# EAGLE board VCAMatrixBottom (EAGLE 8.0.2), part 1 of 2
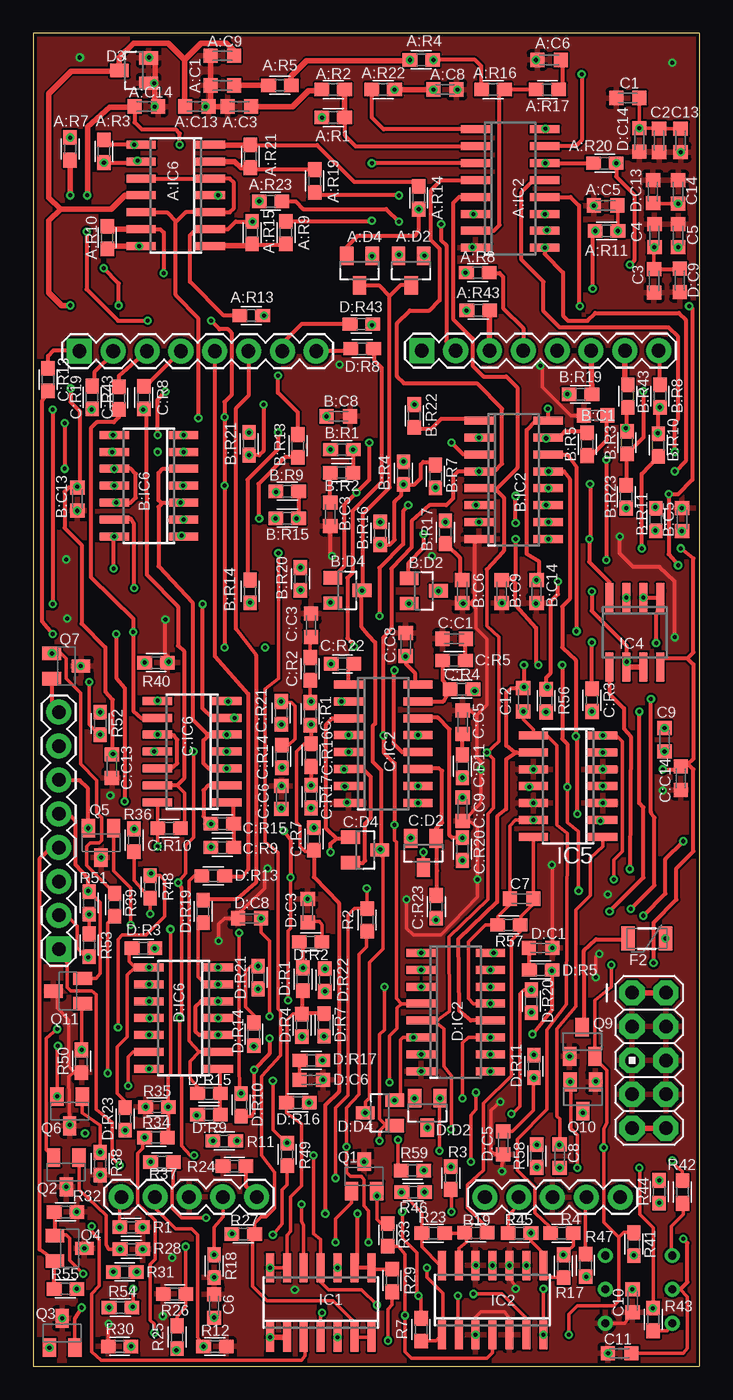
[diagram p2: board, top side]
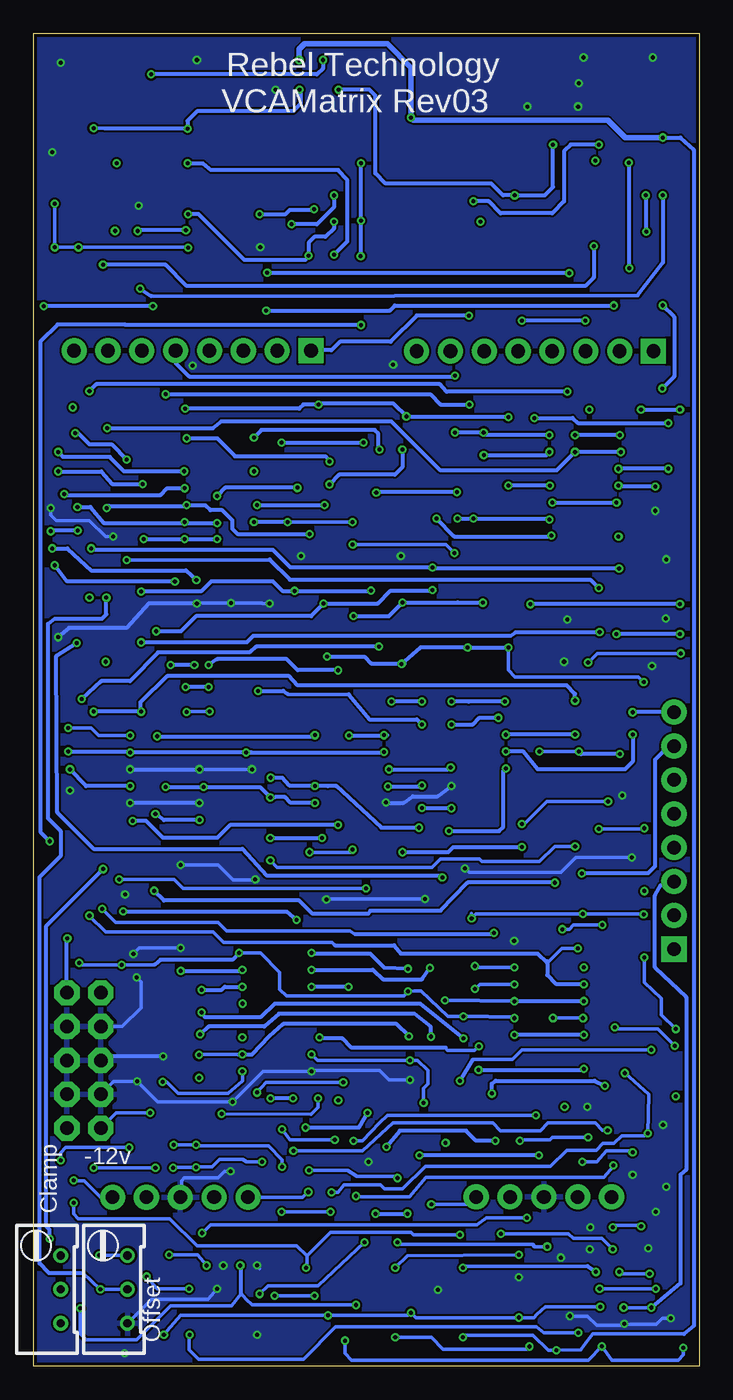
[diagram p3: board, bottom side, seen from below]

Size 50 x 100 mm. Coordinates in mm from the lower left corner, seen from the top.
Outline: 50,100 0,100 0,0 50,0 50,100
Copper layers (1*16): Top 0.035mm / dielectric 1.5mm / Bottom 0.035mm
Design rules "SeeedStudio_2layer_DRU_no_angle_20140221": minimum track width 6mil, minimum drill 12mil, track to track 6mil, track to pad 6mil, pad to pad 6mil, via to via 6mil, smd to smd 0mil, copper to edge 10mil, drill to drill 10mil, minimum pad ring 10mil, minimum via ring 6mil, stop-mask expansion 2mil, vias tented up to drill 100mil, thermal gap 10mil

## Footprints (pad centres in the part's own frame; a part is rotated, then mirrored left to right if it is on the bottom)
C0603K = smd 1.05 x 1.08: 1 -0.875,0; 2 0.875,0
SOT23 = smd 1 x 1.4: 1 -0.95,-1.1; 2 0.95,-1.1; 3 0,1.1
SOIC16N = smd 0.6 x 2.2: 1 -4.445,-2.6; 2 -3.175,-2.6; 3 -1.905,-2.6; 4 -0.635,-2.6; 5 0.635,-2.6; 6 1.905,-2.6; 7 3.175,-2.6; 8 4.445,-2.6; 9 4.445,2.6; 10 3.175,2.6; 11 1.905,2.6; 12 0.635,2.6; 13 -0.635,2.6; 14 -1.905,2.6; 15 -3.175,2.6; 16 -4.445,2.6
SO14 = smd 0.6 x 2.2: 1 -3.81,-2.6; 2 -2.54,-2.6; 3 -1.27,-2.6; 4 0,-2.6; 5 1.27,-2.6; 6 2.54,-2.6; 7 3.81,-2.6; 8 3.81,2.6; 9 2.54,2.6; 10 1.27,2.6; 11 0,2.6; 12 -1.27,2.6; 13 -2.54,2.6; 14 -3.81,2.6
0603 = smd 1.1 x 1: 1 -0.85,0; 2 0.85,0
RTRIM64W = drill 0.61: 1 1.27,-2.54; 2 1.27,0; 3 1.27,2.54
PTC-1206 = smd 1 x 1.8: 1 -1.4,0; 2 1.4,0
SO08 = smd 0.6 x 2.2: 1 -1.905,-2.6; 2 -0.635,-2.6; 3 0.635,-2.6; 4 1.905,-2.6; 5 1.905,2.6; 6 0.635,2.6; 7 -0.635,2.6; 8 -1.905,2.6
1X05 = drill 1.016 pad 1.88: 1 0,0; 2 2.54,0; 3 5.08,0; 4 7.62,0; 5 10.16,0
1X08 = drill 1.016 pad 1.88 square: 1 0,0 | drill 1.016 pad 1.88: 2 2.54,0; 3 5.08,0; 4 7.62,0; 5 10.16,0; 6 12.7,0; 7 15.24,0; 8 17.78,0
AVR_ICSP = drill 1.016 pad 1.88 octagon: 1 -1.27,5.08; 2 1.27,5.08; 3 -1.27,2.54; 4 1.27,2.54; 5 -1.27,0; 6 1.27,0; 7 -1.27,-2.54; 8 1.27,-2.54; 9 -1.27,-5.08; 10 1.27,-5.08
SOT23-BEC = smd 1 x 1.4: B -0.95,-1.1; C 0,1.1; E 0.95,-1.1

## Placement (x,y rotation side)
A:C1  560p  [C0603K]  14.19,96.1 180 top
A:C3  560p  [C0603K]  15.46,94.51 180 top
A:C5  560p  [C0603K]  42.96,87.08 180 top
A:C6  560p  [C0603K]  38.7,98 180 top
A:C8  100n  [C0603K]  30.89,95.78 0 top
A:C9  100n  [C0603K]  14.19,98.32 0 top
A:C13  100n  [C0603K]  12.29,94.51 0 top
A:C14  100n  [C0603K]  8.48,94.51 0 top
A:D2  BAT54A  [SOT23]  28.35,82.19 180 top
A:D4  BAT54A  [SOT23]  24.48,82.19 180 top
A:IC2  SSM2164S  [SOIC16N]  35.78,88.35 270 top
A:IC6  QUAD_OPAMPD  [SO14]  10.7,87.84 90 top
A:R1  30k  [0603]  22.51,93.68 0 top
A:R2  500  [0603]  22.51,95.78 0 top
A:R3  68k  [0603]  5.3,91.14 270 top
A:R4  30k  [0603]  29.11,98 180 top
A:R5  500  [0603]  18.51,96.1 0 top
A:R7  30k  [0603]  2.76,91.33 270 top
A:R8  100k  [0603]  33.35,82.04 0 top
A:R9  560  [0603]  18.95,85.05 90 top
A:R10  68k  [0603]  5.56,84.67 90 top
A:R11  500  [0603]  43.02,85.18 180 top
A:R13  100k  [0603]  16.36,78.82 0 top
A:R14  560  [0603]  28.92,87.65 270 top
A:R15  68k  [0603]  16.41,85.05 90 top
A:R16  30k  [0603]  34.51,95.78 0 top
A:R17  500  [0603]  38.58,95.78 180 top
A:R19  100k  [0603]  21.11,88.92 270 top
A:R20  560  [0603]  42.89,90.26 180 top
A:R21  68k  [0603]  16.29,90.76 270 top
A:R22  5k6  [0603]  26.26,95.78 0 top
A:R23  560  [0603]  17.81,87.4 180 top
A:R43  100k  [0603]  33.39,79.22 0 top
B:C1  560p  [C0603K]  42.21,71.33 180 top
B:C3  560p  [C0603K]  22.28,63.92 270 top
B:C5  560p  [C0603K]  48.68,63.52 90 top
B:C6  560p  [C0603K]  32.2,58.12 270 top
B:C8  100n  [C0603K]  22.88,71.26 0 top
B:C9  100n  [C0603K]  35.16,58.12 90 top
B:C13  100n  [C0603K]  3.31,65.05 270 top
B:C14  100n  [C0603K]  37.76,58.12 270 top
B:D2  BAT54A  [SOT23]  29.31,58.17 270 top
B:D4  BAT54A  [SOT23]  23.57,58.2 270 top
B:IC2  SSM2164S  [SOIC16N]  36.05,66.5 270 top
B:IC6  QUAD_OPAMPD  [SO14]  8.68,66.06 90 top
B:R1  30k  [0603]  23.16,68.76 0 top
B:R2  500  [0603]  23.14,67.04 0 top
B:R3  68k  [0603]  44.56,69.29 90 top
B:R4  30k  [0603]  27.78,67.01 90 top
B:R5  500  [0603]  41.57,69.17 90 top
B:R7  30k  [0603]  30.18,66.75 270 top
B:R8  100k  [0603]  47.03,72.79 90 top
B:R9  560  [0603]  19.06,65.65 180 top
B:R10  68k  [0603]  46.9,69.1 90 top
B:R11  500  [0603]  46.71,63.52 90 top
B:R13  100k  [0603]  19.85,69.04 90 top
B:R14  560  [0603]  16.26,58.13 270 top
B:R15  68k  [0603]  19.06,63.62 180 top
B:R16  30k  [0603]  26.03,62.5 90 top
B:R17  500  [0603]  30.93,62.56 90 top
B:R19  100k  [0603]  41.06,72.91 0 top
B:R20  560  [0603]  20.04,59.07 270 top
B:R21  68k  [0603]  16.2,69.21 270 top
B:R22  5k6  [0603]  28.6,71.29 90 top
B:R23  560  [0603]  44.49,65.23 90 top
B:R43  100k  [0603]  44.62,72.79 90 top
C1  100n  [C0603K]  44.62,95.14 180 top
C2  100n  [C0603K]  46.97,91.96 270 top
C3  100n  [C0603K]  46.59,81.42 270 top
C4  100n  [C0603K]  46.61,84.82 90 top
C5  100n  [C0603K]  48.39,84.82 90 top
C6  100n  [C0603K]  13.57,4.52 90 top
C7  100p  [C0603K]  36.64,35.07 180 top
C8  100p  [C0603K]  39.5,15.77 270 top
C9  100p  [C0603K]  47.38,47.01 270 top
C10  4u7  [C0603K]  44.96,4.91 270 top
C11  4u7  [C0603K]  44.01,0.97 180 top
C12  100p  [C0603K]  36.77,49.99 90 top
C13  100n  [C0603K]  48.58,91.97 270 top
C14  100n  [C0603K]  48.39,88.09 90 top
C:C1  560p  [C0603K]  31.59,54.58 180 top
C:C3  560p  [C0603K]  20.85,55.58 90 top
C:C5  560p  [C0603K]  32.22,48.32 90 top
C:C6  560p  [C0603K]  18.62,42.66 90 top
C:C8  100n  [C0603K]  27.94,54.14 90 top
C:C9  100n  [C0603K]  32.21,41.79 90 top
C:C13  100n  [C0603K]  5.91,45.01 270 top
C:C14  100n  [C0603K]  48.59,44.12 270 top
C:D2  BAT54A  [SOT23]  29.28,38.5 180 top
C:D4  BAT54A  [SOT23]  24.91,38.73 270 top
C:IC2  SSM2164S  [SOIC16N]  26.27,46.71 270 top
C:IC6  QUAD_OPAMPD  [SO14]  11.92,46.11 90 top
C:R1  30k  [0603]  20.78,48.95 90 top
C:R2  500  [0603]  20.78,52.31 270 top
C:R3  68k  [0603]  41.93,49.97 90 top
C:R4  30k  [0603]  32.15,50.79 180 top
C:R5  500  [0603]  31.58,52.95 180 top
C:R7  30k  [0603]  21.05,39.55 90 top
C:R8  100k  [0603]  8.3,72.67 90 top
C:R9  560  [0603]  14.18,38.92 180 top
C:R10  68k  [0603]  10.2,40.35 0 top
C:R11  500  [0603]  32.21,45.01 270 top
C:R13  100k  [0603]  1.11,74.02 90 top
C:R14  560  [0603]  18.64,45.75 270 top
C:R15  68k  [0603]  14.18,40.69 180 top
C:R16  30k  [0603]  20.85,45.84 270 top
C:R17  500  [0603]  20.85,42.73 90 top
C:R19  100k  [0603]  4.41,72.68 90 top
C:R20  560  [0603]  32.21,38.79 90 top
C:R21  68k  [0603]  18.61,49.01 270 top
C:R22  5k6  [0603]  23.2,52.7 180 top
C:R23  560  [0603]  30.24,34.47 270 top
C:R43  100k  [0603]  6.43,72.63 90 top
CLAMP  [RTRIM64W]  49.22,5.76 0 bottom
D3  BAT54A  [SOT23]  7.56,97.21 90 top
D:C1  560p  [C0603K]  38.08,31.38 0 top
D:C3  560p  [C0603K]  20.6,34.17 90 top
D:C5  560p  [C0603K]  35.26,16.75 270 top
D:C6  560p  [C0603K]  20.87,21.48 0 top
D:C8  100n  [C0603K]  16.23,33.6 180 top
D:C9  100n  [C0603K]  48.52,81.46 90 top
D:C13  100n  [C0603K]  46.5,88.12 90 top
D:C14  100n  [C0603K]  45.48,92 270 top
D:D2  BAT54A  [SOT23]  29.57,19 180 top
D:D4  BAT54A  [SOT23]  26.01,19 90 top
D:IC2  SSM2164S  [SOIC16N]  31.71,26.57 270 top
D:IC6  QUAD_OPAMPD  [SO14]  11.28,26.11 90 top
D:R1  30k  [0603]  20.23,29.04 90 top
D:R2  500  [0603]  20.81,31.83 180 top
D:R3  68k  [0603]  8.27,31.35 0 top
D:R4  30k  [0603]  20.16,25.57 270 top
D:R5  500  [0603]  38.08,29.73 0 top
D:R7  30k  [0603]  21.82,25.61 270 top
D:R8  100k  [0603]  24.68,76.34 180 top
D:R9  560  [0603]  13.19,18.88 180 top
D:R10  68k  [0603]  15.59,19.6 90 top
D:R11  500  [0603]  37.57,22.49 90 top
D:R13  100k  [0603]  13.5,36.78 0 top
D:R14  560  [0603]  16.55,24.91 270 top
D:R15  68k  [0603]  13.19,20.46 180 top
D:R16  30k  [0603]  19.85,19.76 0 top
D:R17  500  [0603]  20.87,22.94 0 top
D:R19  100k  [0603]  12.74,34.12 90 top
D:R20  560  [0603]  37.38,27.38 90 top
D:R21  68k  [0603]  16.87,29.16 270 top
D:R22  5k6  [0603]  21.89,28.97 270 top
D:R23  560  [0603]  6.9,18.56 90 top
D:R43  100k  [0603]  24.62,78.18 180 top
F2  PTCSMD  [PTC-1206]  46.04,32.09 180 top
IC1  QUAD_OPAMPD  [SO14]  21.57,4.78 0 top
IC2  QUAD_OPAMPD  [SO14]  34.47,4.95 0 top
IC4  TL072D  [SO08]  45.15,55.05 180 top
IC5  QUAD_OPAMPD  [SO14]  40.14,43.52 90 top
J3  [1X05]  16.76,12.7 180 top
J4  [1X05]  33.89,12.68 0 top
JP1  [1X08]  29.16,76.19 0 top
JP3  [1X08]  3.45,76.16 0 top
JP5  [1X08]  1.91,31.29 90 top
JP8  M05X2PTH  [AVR_ICSP]  46.21,22.94 0 top
OFFSET  [RTRIM64W]  44.21,5.76 0 bottom
Q1  BC856ALT1SMD  [SOT23-BEC]  24.83,14.24 0 top
Q2  BC856ALT1SMD  [SOT23-BEC]  2.48,14.56 180 top
Q3  BC856ALT1SMD  [SOT23-BEC]  2.16,2.49 0 top
Q4  BC856ALT1SMD  [SOT23-BEC]  2.74,8.84 270 top
Q5  BC856ALT1SMD  [SOT23-BEC]  5.08,39.26 180 top
Q6  BC856ALT1SMD  [SOT23-BEC]  2.74,19.13 180 top
Q7  BC856ALT1SMD  [SOT23-BEC]  2.48,52.53 270 top
Q9  BSS84  [SOT23]  41.2,24.34 0 top
Q10  BSS123  [SOT23]  41.24,20.23 180 top
Q11  BC856ALT1SMD  [SOT23-BEC]  2.61,28.15 90 top
R1  100k  [0603]  7.34,10.43 180 top
R2  100k  [0603]  25.06,33.48 270 top
R3  100k  [0603]  31.34,14.12 270 top
R4  100k  [0603]  39.67,9.99 0 top
R7  100k  [0603]  29.1,2.75 270 top
R11  100k  [0603]  14.33,16.91 180 top
R12  100k  [0603]  13.63,1.48 180 top
R17  100k  [0603]  39.79,7.51 270 top
R18  100k  [0603]  13.57,7.51 90 top
R19  100k  [0603]  33.21,10.01 180 top
R23  100k  [0603]  30.01,9.99 180 top
R24  100k  [0603]  15.09,15 0 top
R25  100k  [0603]  10.8,2.18 90 top
R26  22k  [0603]  10.61,5.42 0 top
R27  100k  [0603]  15.75,9.92 180 top
R28  22k  [0603]  7.37,8.78 180 top
R29  100k  [0603]  26.93,6.43 270 top
R30  22k  [0603]  6.48,1.48 0 top
R31  100k  [0603]  6.86,7.07 180 top
R32  22k  [0603]  2.42,11.57 180 top
R33  4k7  [0603]  26.61,9.86 270 top
R34  100k  [0603]  9.21,17.16 0 top
R35  22k  [0603]  9.28,19.45 0 top
R36  4k7  [0603]  7.56,39.45 270 top
R37  100k  [0603]  9.66,15.32 180 top
R38  22k  [0603]  5.02,15.19 90 top
R39  100k  [0603]  6.1,34.62 90 top
R40  22k  [0603]  9.21,52.79 180 top
R41  10k  [0603]  45.06,9.16 90 top
R42  10k  [0603]  48.72,13.07 90 top
R43  10k  [0603]  46.52,3.51 270 top
R44  1k  [0603]  46.97,13.1 270 top
R45  1k  [0603]  36.49,9.99 0 top
R46  1k  [0603]  28.51,13.06 180 top
R47  1k  [0603]  41.44,7.57 270 top
R48  4k7  [0603]  8.77,35.96 270 top
R49  100k  [0603]  19.05,15.89 90 top
R50  22k  [0603]  3.62,22.88 90 top
R51  4k7  [0603]  4.2,34.75 270 top
R52  4k7  [0603]  5.02,48.21 270 top
R53  4k7  [0603]  4.2,31.58 90 top
R54  4k7  [0603]  6.55,4.4 0 top
R55  4k7  [0603]  2.42,5.8 0 top
R56  30k  [0603]  38.49,49.93 270 top
R57  30k  [0603]  35.69,33.1 0 top
R58  30k  [0603]  37.79,15.77 90 top
R59  30k  [0603]  28.45,14.69 0 top

## Tracks (layer width: path | path; a pad name or v marks a point on that pad's centre or on a via)
+12V  (via drill 0.3)
  Top 0.254: R53.2 R51.2 | 21.66,1.67 21.69,1.45 IC1.4 21.57,3.99 v21.66,4.02 | v4.2,51.33 4.2,48.13 R52.2 | v17.72,26.24 17.72,31.89 17.09,32.53 17.09,33.58 D:C8.1 | v27.88,3.8 27.91,4.1 | R33.2 27.4,9.01 27.88,8.4 v27.88,3.8 | v43.38,30.12 43.38,28.46 42.15,27.43 Q9.2 42.17,22.97 42.61,22.62 43.06,22.18 43.06,18.24 42.8,17.8 v42.8,16.4 42.8,10.81 43.95,9.67 | C13.1 C2.1 46.93,92.87 D:C14.1 45.48,95.13 C1.1 | IC2.4 34.47,1.01 34.04,0.59 28.39,0.59 27.88,1.1 v27.88,3.8 | v7.5,5.8 7.5,4.44 v7.46,4.46 | v40.2,2.37 40.2,3.89 40.83,4.53 43.57,4.53 43.95,4.91 43.95,9.67 | 44.91,9.86 R41.2 45.02,10.05 44.33,10.05 43.95,9.67 | v47.95,15.45 47.95,15.26 48.71,14.62 48.71,13.93 R42.2 | R36.2 7.56,36.44 R48.2 v8.77,33.93
  Top 0.305: v13.34,78.44 13.97,77.81 14.61,77.81 14.88,77.54 14.88,72.87 14.36,72.34 v14.36,71.2 v14.36,66.06 v14.36,53.93 | 11.34,66.06 11.41,65.99 11.31,65.99 v11.24,66.06 | Q9.2 42.04,23.2 | 34.34,2.29 IC2.4 | v4.01,85.11 4.01,80.79 6.35,78.44 v8.58,78.44 | B:IC2.16 38.8,70.95 38.87,71.01 | v10.99,91.65 10.99,92.47 10.67,92.79 8.13,92.79 7.6,93.32 A:C14.1 | B:IC2.16 38.65,70.98 38.68,71.01 | v38.61,71.84 38.61,70.98 B:IC2.16 | A:IC2.16 38.38,92.81 v38.42,92.85 | B:IC2.16 37.72,70.95 37.02,70.25 37.02,60.94 37.98,60.36 37.98,59.22 B:C14.1 | 47.06,52.34 47.06,53.15 | 47.06,53.15 IC4.8 | 27.93,52.8 v27.94,53.23 27.94,52.72 28.64,52.02 28.64,51.38 C:IC2.16 28.7,51.24 | 47.06,53.15 49.14,53.15 | 49.14,53.15 49.53,53.55 49.53,60.6 v48.58,61.36 | R52.2 v5.02,47.39 | D:C8.1 17.09,33.61 | v47.25,44.79 48.32,44.79 C:C14.1 49.11,45.2 | 49.14,53.15 49.14,53.06 49.53,52.66 49.53,45.56 49.11,45.2 | 42.1,23.26 Q9.2 | 42.2,23.17 Q9.2 | 42.46,23.74 Q9.2 | R51.2 4.3,33.88 | 49.11,45.2 49.53,44.78 49.53,38.62 48.26,37.36 48.26,35.01 46.55,33.29 v46.55,30.24
  Top 0.406: v13.87,87.84 A:IC6.4 | A:C8.1 30,95.78 30.07,95.86 A:C8.1 | 14.57,46.15 C:IC6.4 | 28.53,51.24 C:IC2.16 28.69,51.22 | 11.34,66.06 B:IC6.4 | 47.11,53.1 IC4.8 | 7.52,94.43 A:C14.1 7.53,94.44 5.72,94.44 4.07,92.98 4.07,88 v4.03,87.84 | D:IC2.16 v34.54,31.01 v34.55,31 | A:R22.2 A:C8.1 | 7.5,4.44 7.71,4.44 R54.2 | C:C8.1 v27.94,53.23
  Bottom 0.254: D:C8.1 17.1,33.98 | v17.72,26.24 18.86,26.24 20.9,28.15 21.4,28.15 D:R22.2 22.18,27.77 30.99,27.77 31.5,28.27 31.5,29.54 32.96,31 v34.55,31 | 17.03,33.67 D:C8.1 | v14.36,53.93 14.36,52.21 13.85,51.71 4.58,51.71 v4.2,51.33 | 40.9,30.12 v43.38,30.12 46.42,30.12 v46.55,30.24 | R55.2 v7.5,5.8 | v47.95,15.45 47.95,16.02 47.57,16.4 v42.8,16.4 | v40.2,2.37 38.95,3.8 v27.88,3.8 21.87,3.8 v21.66,4.02 | v7.46,4.46 11.56,4.46 12.2,3.89 12.44,3.65 C6.1 21.29,3.65 v21.66,4.02 | 21.53,3.89 v21.66,4.02 | D:C8.1 16.77,33.93 v8.77,33.93 4.16,33.93 R51.2
  Bottom 0.305: v8.58,78.44 v13.34,78.44 | D:C8.1 17.15,33.55 | v4.03,87.84 4.03,85.21 v4.01,85.11 | v10.99,91.65 10.99,88.47 11.62,87.84 v13.87,87.84 14.74,87.84 15.63,88.73 23.56,88.73 24.32,89.49 24.32,95.33 24.77,95.78 A:R22.2 | v38.61,71.84 30.04,71.84 29.73,72.14 B:R22.2 28.52,72.22 22.96,72.22 B:C8.1 21.95,71.2 v14.36,71.2 | A:C8.1 29.91,95.68 29.91,94.76 30.48,94.19 37.66,94.19 38.42,93.43 v38.42,92.85 44.64,92.85 D:C14.1 | v48.58,61.36 47.44,61.36 45.66,59.71 38.54,59.71 B:C14.1 | v11.24,66.06 v14.36,66.06 | 14.66,46.25 C:IC6.4 14.51,46.12 13.21,46.12 12.13,44.79 5.59,44.79 5.02,45.36 v5.02,47.39 | v14.36,53.93 v17.4,53.93 20.93,53.93 C:R22.2 | v27.94,53.23 25.15,53.23 24.64,52.72 22.19,52.72 C:R22.2 | 22.13,52.7 C:R22.2 | v17.72,26.24 13.95,26.18 D:IC6.4 | IC5.4 46.04,43.52 v47.25,44.79 | 40.9,30.12 40.45,30.5 35.06,30.5 v34.55,31 | v46.55,30.24 46.39,30.21 | 21.64,4 v21.66,4.02
  other vias: 17.1,33.6 28.6,72.14 37.76,58.99 27.11,95.78 22.01,71.26 30.02,95.78 14.52,46.11 22.35,52.7 42.74,43.52 13.88,26.11 4.2,33.9 21.89,28.12 3.27,5.8 45.48,92.87 13.57,3.65
-12V  (via drill 0.3)
  Top 0.254: v12.07,15.83 11.75,15.83 11.12,16.53 11.12,21.73 10.99,21.86 v10.99,26.12 11.12,26.24 11.12,35.9 v10.86,36.28 11.43,36.98 11.43,39.07 12.01,39.65 v12.01,46.12 12.01,46 | 46.55,4.34 R43.1 46.52,10.39 45.53,11.38 45.53,14.81 v45.47,14.88 | C3.1 46.59,83.92 C4.1 | C14.1 46.53,87.22 D:C13.1 | v40.83,14.88 40.83,17.35 40.33,17.86 40.33,21.23 40.29,21.27 | 40.29,21.27 40.23,21.33 | v25.79,4.59 24.64,5.73 22.17,5.73 21.57,6.33 IC1.11 21.57,9.51 21.02,9.92 v21.02,15.83 | Q10.2 40.29,21.27 | v40.92,35.67 40.92,40.12 40.07,40.78 v40.07,43.45
  Top 0.305: R43.1 46.46,4.61 v46.49,4.34 | 5.88,66.06 B:IC6.11 | A:IC2.9 38.38,83.43 39.76,82.06 39.76,78.82 40.14,78.44 41.6,78.44 42.17,79.01 48.46,79.01 48.96,78.5 48.96,67.9 48.2,67.14 v48.14,67.14 | v36.2,62.06 36.2,59.26 35.95,59.01 | 35.44,59.27 B:C9.2 35.17,59.01 35.95,59.01 | 35.95,59.01 36.2,58.76 36.2,57.1 37.72,55.39 37.72,52.79 v37.91,52.6 | v41.79,66.18 41.79,62.12 v41.72,62.06 41.72,60.34 43.25,58.82 IC4.4 | v2.8,73.36 2.8,72.34 3.5,71.64 3.5,66.24 B:C13.1 | C:C13.1 6.16,45.93 v5.97,45.93 5.97,49.99 5.4,50.63 5.4,53.93 3.62,55.71 3.62,61.61 2.35,62.88 2.35,65.61 2.67,65.93 B:C13.1 | B:C13.1 v3.31,65.99 | v3.31,65.99 | IC5.11 v37.22,43.45 | 40.1,43.3 v40.07,43.45 40.07,46.69 39.69,47.07 v39.69,52.6 | C3.1 48.48,82.3 D:C9.2
  Top 0.406: 28.64,42.24 C:IC2.9 | 9.31,46.12 C:IC6.11 9.07,46.11 v9.06,46.12 | A:IC6.11 6.89,87.84 5.85,86.79 2.04,86.79 | 2.04,86.79 1.17,85.94 1.17,80.54 2.13,79.59 v2.76,79.59 | 6.3,97.05 6.42,97.17 | 11.35,98.03 11.35,94.57 A:C13.1 | A:C9.2 15.07,98.72 14.51,99.27 12.6,99.27 11.35,98.03 | 11.35,98.03 10.11,99.27 7.52,99.27 6.46,98.21 D3.3 6.42,97.17 | 2.04,86.79 1.17,87.66 1.17,95.48 2.86,97.17 6.42,97.17 | 8.11,26.11 D:IC6.11 v8.74,26.11
  Bottom 0.254: 34.29,7.6 IC2.11 | v10.99,26.12 v8.74,26.12 v8.74,26.11 | A:IC2.9 38.42,83.94 C4.1 C5.1 C14.1 | 34.42,5.48 34.04,5.03 33.6,4.59 v25.79,4.59 | v40.83,14.88 45.6,14.88 | Q10.2 39.99,21.33 39.12,20.46 35.37,20.46 34.31,21.4 D:IC2.9 | 34.42,6.05 34.42,5.42 35.12,4.53 39.69,4.53 42.23,1.99 46.04,1.99 46.49,2.43 v46.49,4.34 | v9.06,46.12 v12.01,46.12
  Bottom 0.305: IC2.11 34.42,7.57 | 34.29,7.51 IC2.11 | v2.76,79.59 1.9,78.73 1.9,74.25 v2.8,73.36 | v41.72,62.06 B:IC2.9 36.14,62.05 v36.2,62.06 | v48.14,67.14 44.9,67.14 44.07,66.18 v41.79,66.18 41.72,66.25 | 6.05,66.08 B:IC6.11 6.02,65.99 v3.31,65.99 | 8.93,46.05 v9.06,46.12 | 28.89,42.26 29.04,42.26 | 28.89,42.26 28.87,42.24 | v40.07,43.45 v37.22,43.45 33,43.45 C:C9.2 31.87,42.69 31.12,42.69 30.69,42.26 C:IC2.9 28.89,42.26 | 9,46.05 v9.06,46.12 | v5.97,45.93 8.87,45.93 v9.06,46.12 | v10.86,36.28 17.4,36.28 19.44,34.18 24.71,34.18 24.88,33.94 29.04,33.94 30.04,34.94 40.19,34.94 v40.92,35.67 | 34.42,5.48 34.42,6.05 34.42,7.47 IC2.11 | v45.47,14.88 45.6,14.88 | 34.29,22.1 D:IC2.9 | v12.07,15.83 v21.02,15.83 | v37.91,52.6 v39.69,52.6
  other vias: 34.47,7.55 38.65,62.06 6.08,66.06 32.21,42.67 48.39,87.22 48.39,83.94 46.61,83.94 38.38,83.91 28.87,42.26 34.31,22.12 40.29,21.33
A:IC2_1  (via drill 0.3)
  Top 0.305: A:IC6.14 v7.95,84.03 v7.94,84.03 | A:R20.1 43.74,89.25 45.09,87.9 45.09,82.95 v44.77,82.63
  Top 0.406: A:IC6.14 5.77,84.03 A:R10.1
  Bottom 0.305: v7.94,84.03 7.94,81.68 8.58,81.04 38.49,81.04 40.07,82.63 v44.77,82.63
  other vias: 43.74,90.26
A:IC2_2  (via drill 0.3)
  Top 0.305: A:IC6.13 9.53,85.3 9.78,85.04 v9.78,82 | v32.44,82.04 A:R8.1
  Top 0.406: A:IC6.13 5.77,85.3 A:R10.2
  Bottom 0.305: v32.44,82.04 9.83,82.04 v9.78,82
A:IC2_3
  Top 0.305: A:R15.1 16.25,84.03 A:IC6.1 13.42,84.16 18.91,84.16 A:R9.1
A:IC2_4  (via drill 0.3)
  Top 0.305: A:IC6.9 7.87,90.38 v7.82,90.44 7.67,90.29 A:R3.2 | A:R43.1 32.53,79.09 v32.52,79.2 | v6.42,79.58 6.42,81.23 v5.27,82.38
  Bottom 0.305: v32.52,79.2 23.25,79.2 22.86,79.58 v6.42,79.58 | v5.27,82.38 5.27,90.27 A:R3.2
  other vias: 5.3,90.29
A:IC2_5  (via drill 0.3)
  Top 0.305: v16.45,85.87 A:R15.2 16.39,85.87 15.18,85.87 14.61,85.3 A:IC6.2 13.24,85.36 12.26,85.36 11.75,84.85 11.75,81.36 14.29,78.82 A:R13.1
  Top 0.406: 14.19,85.3 A:IC6.2
A:IC2_6
  Top 0.305: A:R21.1 21.31,91.61 24.07,88.85 28.82,88.85 A:R14.1 29.18,88.51
  Top 0.406: A:R21.1 13.34,91.61 A:IC6.7
A:IC2_7
  Top 0.305: 13.39,90.29 A:IC6.6 | A:R21.2 16.39,89.81 21.07,89.81 A:R19.1
  Top 0.406: A:R21.2 15.58,89.91 15.12,90.38 A:IC6.6
A:IC2_11  (via drill 0.3)
  Top 0.305: A:R3.1 5.65,91.65 v7.56,91.65 v7.57,91.65 A:IC6.8
  Bottom 0.305: v7.56,91.65 9.66,91.65 10.16,91.14 10.16,87.39 11.05,86.51 14.93,86.51 15.82,87.39 A:R23.2
  other vias: 16.96,87.4
A:N$1  (via drill 0.3)
  Top 0.305: A:IC2.3 v25.41,90.26 v25.4,90.25 | A:R9.2 25.37,85.9 v25.4,85.93
  Bottom 0.305: A:D4.1 25.4,83.31 v25.4,85.93 v25.4,90.25
  other vias: 25.43,83.29
A:N$2
  Top 0.406: A:C1.1 A:R5.1
A:N$3
  Top 0.406: A:C3.1 19.44,94.51 20.64,95.71 21.59,95.71 A:R2.1
A:N$4  (via drill 0.3)
  Top 0.305: v41.15,96.92 41.15,91.97 40.71,91.52 38.61,91.52 38.55,91.59
  Top 0.406: 28.16,97.9 A:R4.2 | A:R4.2 | A:R5.2 19.36,96.78 20.52,97.93 28.2,97.93 A:R4.2 | A:IC2.15 38.49,91.53 38.55,91.59
  Bottom 0.305: A:R4.2 28.26,97.36 28.71,96.92 v41.15,96.92
  other vias: 28.26,98
A:N$5
  Top 0.305: A:R1.2 23.36,92.36 24.2,91.52 A:IC2.2
  Top 0.406: A:R2.2 A:R1.2
A:N$7  (via drill 0.3)
  Top 0.305: A:IC2.6 v33.03,86.45 v33.02,86.44 | A:R14.2 28.92,85.2 28.64,84.79 24.32,84.79 23.56,84.03 23.56,83.33 A:D4.2
  Bottom 0.305: v33.02,86.44 31.06,86.44 30.74,86.76 29.22,86.76 A:R14.2
  other vias: 28.92,86.8
A:N$8  (via drill 0.3)
  Top 0.305: 29.3,83.12 A:D2.1 v29.34,83.33 | 37.6,86.44 A:IC2.11 | A:R23.1 19.69,87.4 20.26,86.82 26.48,86.82 v27.44,85.87
  Bottom 0.305: A:IC2.11 37.6,86.44 34.17,83.01 29.58,83.01 A:D2.1 v29.34,83.33 29.34,84.28 28.9,84.73 28.07,84.73 27.44,85.36 v27.44,85.87
  other vias: 38.38,86.45
A:N$11
  Top 0.305: 39.7,97.98 39.7,96.06 A:R17.1
  Top 0.406: 39.7,97.98 39.6,97.98 A:C6.1
A:N$12
  Top 0.305: A:IC2.7 34.55,85.17 34.99,85.62 34.99,95.41 A:R16.2 | 35.56,95.58 A:R16.2 | A:R17.2 A:R16.2
A:N$14  (via drill 0.3)
  Top 0.305: A:R20.2 A:IC2.14 v38.42,90.26 v38.42,90.25 | A:D2.2 27.4,83.42 v27.44,83.39
  Bottom 0.305: v38.42,90.25 37.28,90.25 36.64,89.74 27.12,89.74 26.42,88.98 26.42,84.41 v27.44,83.39
A:N$17
  Top 0.305: A:IC2.1 26.29,92.8 25.4,93.68 A:R22.1
A:N$19  (via drill 0.3)
  Top 0.254: A:R11.1 43.87,87.04 A:C5.1
  Bottom 0.305: 43.87,85.11 A:R11.1
  other vias: 43.87,85.18
A:N$23  (via drill 0.3)
  Top 0.305: A:IC2.10 38.49,85.17 v38.55,85.23 | v41.98,80.85 41.98,84.98 A:R11.2
  Top 0.406: A:R7.2 v2.76,87.84 | A:IC2.10 38.3,85.17
  Bottom 0.305: v41.98,80.85 41.15,80.28 4.64,80.34 2.73,82.82 2.73,87.82 v2.76,87.84 | v38.55,85.23 42.11,85.23 A:R11.2
  other vias: 42.17,85.18
B:IC2_1  (via drill 0.3)
  Top 0.305: B:IC6.14 5.89,62.21 5.91,62.18 | v45.66,61.36 45.66,66.95 B:R10.1 | 5.91,62.22 B:IC6.14 | v6.04,59.84 6.04,62.21 B:IC6.14
  Bottom 0.305: v45.66,61.36 45.53,61.23 32.01,61.23 30.7,59.92 B:R20.1 20.02,59.9 6.1,59.9 v6.04,59.84 | 6.1,62.22 B:IC6.14
  other vias: 20.04,59.92 6.08,62.25
B:IC2_2  (via drill 0.3)
  Top 0.305: B:R10.2 v46.87,69.99 46.9,70.03 46.9,71.81 B:R8.1 | v42.99,68.03 v42.99,60.47 | v7.56,58.37 7.56,63.2 7.31,63.58 6.21,63.58 B:IC6.13
  Bottom 0.305: v46.87,69.99 46.61,69.99 45.79,69.17 44.14,69.17 v42.99,68.03 | v42.99,60.47 32.26,60.53 30.74,59.01 8.2,59.01 v7.56,58.37
  other vias: 47.03,71.94
B:IC2_3  (via drill 0.3)
  Top 0.305: B:IC6.1 11.09,62.28 v11.12,62.31 | 19.59,63.43 B:R15.1 | B:R15.1 19.78,63.62 v19.75,63.58 19.91,63.73 | B:R9.1 B:R15.1
  Top 0.406: 10.55,62.18 11.03,62.18 B:IC6.1
  Bottom 0.305: v11.12,62.31 11.18,62.25 18.42,62.25 v19.75,63.58
B:IC2_4  (via drill 0.3)
  Top 0.305: B:R43.1 44.55,71.87 B:R3.2 44.54,70.14 v44.45,70.38 | B:IC6.9 v5.91,68.6
  Bottom 0.305: v44.45,70.38 36.52,70.38 35.88,70.88 23.12,70.88 19.44,67.2 10.74,67.2 v9.34,68.6 v5.91,68.6
B:IC2_5  (via drill 0.3)
  Top 0.305: 10.23,63.45 11.15,63.45 B:IC6.2 11.09,63.52 | B:R15.2 18.08,63.55 v18.17,63.58 | B:R13.1 18.9,68.19 16.9,66.18 16.9,63.64 v16.96,63.58
  Bottom 0.305: 11.09,63.52 B:IC6.2 11.34,63.58 v16.96,63.58 v18.17,63.58
  other vias: 11.28,63.52
B:IC2_6  (via drill 0.3)
  Top 0.305: B:R21.1 | B:R21.1 | B:R21.1 16.26,70.12 16.26,70.06 | v18.36,70.06 18.36,68.79 16.07,66.5 16.07,59.17 B:R14.1
  Bottom 0.305: B:IC6.7 16.01,69.87 B:R21.1 18.1,70.06 v18.36,70.06
  other vias: 11.28,69.87 16.2,70.06
B:IC2_7  (via drill 0.3)
  Top 0.305: B:R19.1 40.13,72.98 v40.07,72.92 | B:R21.2 v16.2,68.34 16.96,68.34 17.28,68.66 v17.28,72.15
  Bottom 0.305: 11.15,68.66 B:IC6.6 11.53,68.34 v16.2,68.34 | v40.07,72.92 20.2,72.92 19.44,72.15 v17.28,72.15
  other vias: 11.28,68.6
B:IC2_11  (via drill 0.3)
  Top 0.305: 44.52,68.28 44.52,66.62 B:R23.2 | B:IC6.8 v5.97,69.87 | v45.79,73.17 45.79,69.68 B:R3.1 | v9.34,69.87 9.34,72.53 v9.91,73.11
  Top 0.406: B:R3.1 44.55,68.32 44.52,68.28
  Bottom 0.305: v5.97,69.87 v9.34,69.87 | v45.79,73.17 45.28,73.68 19.5,73.68 18.99,73.11 v9.91,73.11
B:N$1  (via drill 0.3)
  Top 0.305: B:R9.2 v18.21,65.59 | B:D4.1 23.31,59.99 23.31,64.6 v24.26,65.55 25.21,66.5 v25.21,69.3 | B:IC2.3 32.26,68.41 v31.37,69.3
  Bottom 0.305: 24.24,65.59 v24.26,65.55 23.92,65.59 v18.21,65.59 | v31.37,69.3 v25.21,69.3
B:N$2
  Top 0.305: B:R5.1 41.34,68.34 41.91,68.34 43.06,69.49 43.06,71.3 B:C1.1
B:N$3
  Top 0.305: B:C3.1 22.28,67.03 B:R2.1
B:N$4  (via drill 0.3)
  Top 0.305: B:R5.2 41.1,70.12 39.88,70.12 39.44,69.68 | B:IC2.15 38.55,69.67 v38.49,69.61
  Top 0.406: B:IC2.15 39.44,69.68
  Bottom 0.305: v38.49,69.61 36.2,69.61 34.87,68.28 28.07,68.28 B:R4.2
  other vias: 27.78,67.86
B:N$5  (via drill 0.3)
  Top 0.305: 33.32,69.55 B:IC2.2 | B:R1.2 24.01,67.06 B:R2.2
  Bottom 0.305: B:IC2.2 32.87,70.25 24.39,70.25 24.13,69.99 24.13,68.89 B:R1.2
  other vias: 33.45,69.68 24.01,68.76
B:N$7  (via drill 0.3)
  Top 0.305: B:D4.2 22.34,57.25 v22.29,57.29 | B:IC2.6 33.15,64.59 33.02,64.47 33.09,64.47 v33.21,64.6 | v28.13,64.6 28.13,64.53 27.75,64.15 27.75,61.68 25.98,59.9 v25.98,56.28
  Bottom 0.305: B:R14.2 18.15,57.29 v22.29,57.29 23.31,56.28 v25.98,56.28 | v33.21,64.6 v28.13,64.6
  other vias: 16.26,57.28
B:N$8  (via drill 0.3)
  Top 0.305: 44.4,64.47 B:R23.1 44.34,64.53 | 38.99,64.53 38.93,64.47 38.77,64.47 B:IC2.11 v38.49,64.59 v38.49,64.6 | 28.2,59.33 B:D2.1 28.13,59.19 28.13,60.22 29.28,61.42 v29.28,62.44
  Bottom 0.305: B:R23.1 44.34,64.53 38.55,64.53 v38.49,64.6 37.09,64.6 36.71,64.22 35.82,64.22 35.06,63.45 35.06,62.82 34.68,62.44 v29.28,62.44
  other vias: 44.49,64.38
B:N$11
  Top 0.305: 30.93,61.62 31.04,61.62 32.01,60.66 32.01,59.18 B:C6.1
  Top 0.406: 30.93,61.62 B:R17.1
B:N$12  (via drill 0.3)
  Top 0.305: B:R16.2 v26.03,63.34 v26.04,63.33
  Top 0.406: v30.93,63.33 B:R17.2 30.93,63.35
  Bottom 0.254: v26.04,63.33 v30.93,63.33
  Bottom 0.305: 26.13,63.41 v26.04,63.33 | v30.93,63.33 B:IC2.7
  other vias: 33.45,63.33
B:N$14  (via drill 0.3)
  Top 0.305: B:IC2.14 40.07,68.41 40.77,67.45 v40.77,55.14 | B:D2.2 27.83,57.22 27.88,57.17
  Bottom 0.305: v40.77,55.14 38.93,55.14 37.79,56.28 29.15,56.28 B:D2.2 24.14,57.22 23.18,58.18 20.08,58.18 B:R20.2
  other vias: 28.21,57.22 20.04,58.22
B:N$17
  Top 0.305: B:IC2.1 33.32,71.07 30.61,71.07 29.85,70.31 28.73,70.31 B:R22.1
B:N$19  (via drill 0.3)
  Top 0.305: B:R11.1 46.8,62.69 v46.68,62.69
  Bottom 0.305: 48.44,62.69 B:C5.1 48.63,62.69 v46.68,62.69
  other vias: 48.68,62.64
B:N$23  (via drill 0.3)
  Top 0.254: B:R11.2 46.71,64.44 v46.69,64.47
  Top 0.305: B:IC2.10 38.42,63.33 | 38.36,63.26 38.42,63.2 38.77,63.2 38.77,63.23 38.74,63.26 | v36.2,63.26 v36.2,65.3
  Top 0.406: 38.36,63.26 38.1,63.26 38.17,63.33 38.42,63.33
  Bottom 0.254: v46.69,64.47 46.75,64.47
  Bottom 0.305: v46.69,64.47 46.75,64.47 45.72,64.47 44.71,63.26 38.58,63.26 | B:R7.2 35.59,65.9 v36.2,65.3 | 38.58,63.26 v36.2,63.26 | 38.58,63.26 B:IC2.10
  other vias: 30.18,65.9 38.65,63.33
C:IC2_1  (via drill 0.3)
  Top 0.254: C:IC6.14 9.35,42.27 C:R10.1 9.35,39.01 v9.34,39.01
  Top 0.305: 9.97,42.25 9.37,42.25 C:IC6.14
  Bottom 0.254: v9.34,39.01 10.86,39.01 12.01,37.86 16.32,37.86 16.51,38.05 19.44,38.05 20.07,37.42 31.69,37.42 C:R20.1
  other vias: 32.21,37.94
C:IC2_2  (via drill 0.3)
  Top 0.254: C:IC6.13 10.81,43.57 11.37,43.01 11.37,40.68 C:R10.2 10.99,40.34
  Top 0.305: 8.45,71.65 C:R8.1 | 8.45,71.65 8.2,71.65 v8.26,71.77 | 8.45,71.65 8.51,59.39 10.86,56.98 10.86,54.06 11.31,53.68 11.31,44.09 10.8,43.58 C:IC6.13
C:IC2_3
  Top 0.305: 14.56,42.26 14.43,42.26 | 14.99,40.73 C:R15.1 | C:R15.1 15.03,42.24 15.09,42.31 | C:R15.1 C:R9.1
  Top 0.406: 14.88,42.2 14.77,42.31 | 15.09,42.31 14.77,42.31 | 14.77,42.31 C:IC6.1 14.56,42.26 14.73,42.26 14.77,42.31
C:IC2_4  (via drill 0.3)
  Top 0.305: C:R43.1 6.74,71.65 C:R43.1 6.42,71.2 6.04,70.82 4.77,70.82 4.32,70.38 4.32,59.2 7.5,56.09 v7.5,55.07 7.5,49.17 8.13,48.6 9.27,48.6 C:IC6.9 | C:R3.2 41.93,54.3 v41.91,54.31
  Bottom 0.305: v41.91,54.31 33.98,54.31 33.47,54.82 14.16,54.82 13.78,55.07 v7.5,55.07
C:IC2_5  (via drill 0.3)
  Top 0.305: C:R13.1 0.64,72.38 0.64,55.9 v1.47,54.95 | 13.72,43.58 13.85,43.45 14.41,43.45 C:IC6.2 13.14,43.57 12.77,43.2 12.77,41.25 C:R15.2 12.86,40.69 | v6.23,54.95 6.23,51.64 6.86,50.88 v6.86,42.37
  Top 0.406: 14.54,43.55 C:IC6.2 14.51,43.58
  Bottom 0.254: v6.86,42.37 11.45,42.37 13.23,40.59
  Bottom 0.305: v1.47,54.95 v6.23,54.95 | 13.23,40.59 C:R15.2
  other vias: 13.33,40.69
C:IC2_6  (via drill 0.3)
  Top 0.254: C:R14.1 19.15,46.6 19.63,47.07 19.63,49.55 19.37,49.8 18.67,49.8 C:R21.1
  Top 0.305: C:IC6.7 14.56,49.92 v14.61,49.87 | C:R21.1 18.73,49.87
  Bottom 0.305: v14.61,49.87 17.34,49.87 C:R21.1
  other vias: 18.61,49.86
C:IC2_7  (via drill 0.3)
  Top 0.305: v12.7,57.17 12.7,49.36 13.4,48.66 14.51,48.66 C:IC6.6 | C:R21.2 18.62,48.16 v18.61,48.15 | C:R19.1 4.6,71.8 v4.39,71.77 | v1.47,71.77 v1.47,57.17
  Top 0.406: C:IC6.6 v15.09,48.65 15.08,48.66
  Bottom 0.305: v18.61,48.15 17.02,48.15 16.51,48.66 v15.1,48.66 v15.09,48.65 | v4.39,71.77 v1.47,71.77 | v1.47,57.17 v12.7,57.17
C:IC2_11  (via drill 0.3)
  Top 0.305: C:IC6.8 v9.34,49.93 | C:R3.1 | C:R3.1 v41.91,49.1 | C:R23.2 30.38,33.39 v30.23,33.48 | v45.47,49.1 45.47,42.25 45.79,41.93 45.79,36.66 v43.25,34.12
  Bottom 0.305: v9.34,49.93 9.34,50.44 9.97,51.07 30.17,51.07 30.8,51.77 39.95,51.77 41.98,49.8 41.98,49.17 v41.91,49.1 v45.47,49.1 | v43.25,34.12 30.99,34.12 v30.23,33.48
C:N$1  (via drill 0.3)
  Top 0.305: C:R9.2 13.33,38.93 v13.34,38.94 | 23.31,39.71 23.78,39.71 C:D4.1 | 23.31,39.71 23.31,39.96 | C:IC2.3 23.66,48.6 22.42,48.6 21.98,48.15 21.98,40.34 22.74,39.58 | v22.29,38.56 22.29,39.2 22.74,39.58 | 22.74,39.58 23.18,39.58 23.31,39.71
  Top 0.406: 23.44,48.59 C:IC2.3 24.09,48.61 24.11,48.59 24.43,48.59
  Bottom 0.305: v22.29,38.56 18.86,38.56 18.48,38.94 v13.34,38.94
C:N$2
  Top 0.305: C:R5.1 32.43,54.49 C:C1.1
C:N$3
  Top 0.254: C:R2.1 20.78,54.64 C:C3.1
C:N$4
  Top 0.305: 29.02,50.03 C:IC2.15 30.77,49.88 C:R4.2 30.74,51.45 30.74,52.94 C:R5.2
C:N$5  (via drill 0.3)
  Top 0.254: C:R1.2 C:R2.2
  Top 0.305: C:R1.2 20.77,50.05 v20.83,49.87 | C:IC2.2 23.13,49.88 v23.12,49.87 | 20.74,49.96 v20.83,49.87 | 20.81,50.09 v20.83,49.87
  Top 0.406: 23.4,49.86 C:IC2.2 23.44,49.86 | 20.72,49.99 C:R1.2
  Bottom 0.305: v20.83,49.87 v23.12,49.87
C:N$7  (via drill 0.3)
  Top 0.254: C:R14.2 18.66,44.9 | 18.66,44.9 v18.67,44.91 | C:R14.2 18.66,44.9 | 18.66,44.9 v18.67,44.91 | C:R14.2 18.66,44.9 | 18.66,44.9 v18.67,44.91
  Top 0.305: 18.82,45.02 C:R14.2 | C:IC2.6 23.32,44.8 v23.31,44.79 | 23.63,37.8 23.65,37.78 C:D4.2 23.85,37.74 24.71,37.74 24.9,37.93 24.9,40.72 25.34,41.17 25.34,44.21 24.64,44.91 23.78,44.91 C:IC2.6 | 23.47,44.85 C:IC2.6
  Top 0.406: 23.36,44.86 C:IC2.6 23.4,44.78 | v18.67,44.91 18.65,44.91 C:R14.2
  Bottom 0.254: v18.67,44.91 18.69,44.91 18.7,44.9
  Bottom 0.305: v23.31,44.79 18.88,44.79 18.7,44.9
C:N$8
  Top 0.254: C:IC2.11 28.87,44.76 28.83,44.72
  Top 0.305: 28.64,44.78 28.7,44.78 28.71,44.79 | C:D2.1 30.23,40.34 30.68,40.78 30.68,44.66 30.42,44.85 29.05,44.85 C:IC2.11 | 28.83,44.72 28.77,44.79 28.83,44.79 | 30.37,39.46 C:D2.1 | C:D2.1 | C:R23.1 30.29,35.32 30.29,37.17 30.31,39.52 C:D2.1
  Top 0.406: 28.6,44.78 C:IC2.11 28.64,44.78
C:N$11  (via drill 0.3)
  Top 0.305: C:C6.1 18.75,41.79 v18.61,41.86
  Bottom 0.305: C:R17.1 18.88,41.88 v18.61,41.86
  other vias: 20.85,41.88
C:N$12  (via drill 0.3)
  Top 0.305: C:R16.2 C:R17.2
  Top 0.406: C:IC2.7 23.4,43.51 v23.38,43.49
  Bottom 0.305: v23.38,43.49 20.93,43.49 C:R17.2
  other vias: 20.85,43.58
C:N$14  (via drill 0.3)
  Top 0.305: 28.63,48.6 C:IC2.14 | 28.89,48.6 C:IC2.14 | 32.17,39.6 C:R20.2 31.44,39.64 31.25,39.83 31.25,47.77 30.36,48.66 28.92,48.66 C:IC2.14
  Top 0.406: 28.6,48.59 C:IC2.14 28.64,48.59 | C:D2.2 v28.33,39.64
  Bottom 0.305: 28.39,39.58 v28.33,39.64 | 28.4,39.58 28.39,39.58 | C:R20.2 28.45,39.64 28.39,39.58
  other vias: 32.21,39.64
C:N$17
  Top 0.305: C:IC2.1 23.67,52.51 C:R22.1
C:N$19
  Top 0.305: 32.07,45.86 C:R11.1 32.21,47.38 C:C5.1
C:N$23  (via drill 0.3)
  Top 0.305: C:R11.2 31.87,44.14 v32.2,44.15
  Bottom 0.305: C:R7.2 21.18,40.4 23.88,40.4 27.25,43.52 27.89,43.52 28.74,43.53 C:IC2.10 28.92,43.58 30.8,43.58 31.31,44.15 v32.2,44.15
  other vias: 21.05,40.4 28.87,43.53
CLAMP_REF  (via drill 0.3)
  Top 0.254: D:D4.3 24.91,19.85 25.21,20.15 25.21,30.31 26.23,31.32 26.23,38.18 26.01,38.4 C:D4.3
  Top 0.305: A:D4.3 25.93,81.09 26.74,80.28 | 26.74,80.28 26.74,65.93 24.71,63.9 24.71,58.24 B:D4.3 24.64,58.18 24.64,55.45 25.12,54.85 25.66,54.31 25.66,48.21 25.47,48.02 25.47,45.36 26.1,44.72 26.1,38.82 C:D4.3 v26.04,38.75 | A:D2.3 27.55,81.09 26.74,80.28 | C:D2.3 v29.28,38.56 | 24.96,18.89 D:D4.3 | 24.52,19.02 D:D4.3 | 24.77,19.02 D:D4.3 | v41.91,58.12 41.91,56.66 44.52,54.06 44.52,52.88 v44.55,52.85
  Top 0.406: IC4.7 IC4.6 44.62,53.05 v44.55,52.85 | 25.91,38.63 C:D4.3 | 24.93,57.94 B:D4.3
  Bottom 0.254: v29.28,38.56 26.11,38.56 25.98,38.69
  Bottom 0.305: B:D4.3 24.7,58.17 B:D2.3 29.95,58.12 31.25,58.12 32.01,58.88 36.64,58.88 37.41,58.12 v41.91,58.12 | 44.52,52.95 v44.55,52.85 | 26.1,38.62 25.98,38.69 C:D4.3 v26.04,38.75 | D:D2.3 25.57,17.9 D:D4.3
  other vias: 30.41,58.17 24.67,58.2 29.57,17.9 24.91,19
CV_AA  (via drill 0.3)
  Top 0.406: A:R13.2 v17.31,78.82
  Bottom 0.305: v17.31,78.82 21.22,78.82 23.18,76.85 26.99,76.85 27.63,76.22 29.13,76.22 JP1.1
CV_AB  (via drill 0.3)
  Top 0.305: v27.44,87.84 21.35,87.84 A:R19.2 | JP1.2 31.24,76.65 31.12,76.77 30.99,76.9 30.99,84.09 30.61,84.47 v30.61,85.68
  Bottom 0.305: v27.44,87.84 27.44,86.95 28.71,85.68 v30.61,85.68
CV_AC
  Top 0.406: A:R43.2 JP1.3
CV_AD
  Top 0.305: A:R8.2 34.24,82.01 34.98,82.01 35.25,81.74 35.25,79.39 36.77,77.87 36.77,76.2 JP1.4 36.83,76.25
CV_BA  (via drill 0.3)
  Top 0.305: 18.29,74.25 v18.36,74.31 18.36,73.04 19.85,71.55 B:R13.2
  Bottom 0.305: JP1.5 39.31,75.27 38.3,74.25 18.42,74.25 v18.36,74.31
CV_BB
  Top 0.406: B:R19.2 JP1.6
CV_BC
  Top 0.406: JP1.7 44.4,73.86 B:R43.2
CV_BD
  Top 0.305: B:R8.2 47.03,76.1 JP1.8
CV_CA
  Top 0.305: C:R13.2 1.11,75.8 1.53,76.22 3.39,76.22
  Top 0.406: 3.39,76.22 JP3.1
CV_CB
  Top 0.305: JP3.2 5.99,75.98 4.58,74.57 4.58,73.56 C:R19.2
CV_CC
  Top 0.305: C:R43.2 6.43,74.3 JP3.3
CV_CD
  Top 0.305: JP3.4 8.74,73.82 8.6,73.82 C:R8.2
CV_DA
  Top 0.305: JP3.5 13.61,53.27 16.13,50.44 16.13,37.29 15.69,36.72 14.41,36.72 D:R13.2
CV_DB
  Top 0.305: JP3.6 16.15,72.81 15.18,71.84 15.18,55.33 16.71,53.36 16.71,36.28 15.31,35.07 12.72,35.07 D:R19.2
CV_DC
  Top 0.305: D:R43.2 20.13,78.18 18.67,76.73 18.69,76.7 JP3.7
CV_DD
  Top 0.305: 23.57,76.16 JP3.8
  Top 0.406: 23.57,76.16 D:R8.2
D:IC2_1  (via drill 0.3)
  Top 0.254: D:R10.1 16.39,18.75 16.58,19.07 v16.58,22.24
  Top 0.305: v17.72,24.59 17.72,23.45 v16.58,22.24
  Bottom 0.305: v16.58,22.24 8.74,22.24 D:IC6.14 | v17.72,24.59 20.96,27.2 31.88,27.2 32.96,26.18 37.09,26.18 D:R20.1
  other vias: 37.38,26.53 8.68,22.3
D:IC2_2  (via drill 0.3)
  Top 0.254: 8.56,23.45 D:IC6.13 7.5,23.57 7.12,23.2 v7.12,21.04 | D:R10.2 15.46,20.63 15.44,22.75 v15.44,32.5 v15.43,32.5
  Top 0.305: v24.07,53.99 23.56,54.63 23.56,59.14 23.94,59.52 23.94,64.15 26.17,66.38 26.17,74.88 25.6,75.45 25.6,76.28 D:R8.1 25.47,75.96 | 7.75,23.58 D:IC6.13 | v44.84,34.31 46.61,36.09 46.61,41.17 46.36,41.55 v46.36,50.05
  Bottom 0.254: 43.5,33.29 36.14,33.29 35.5,32.66 26.23,32.66 25.85,32.4 | 43.5,33.29 43.37,33.29 | 43.5,33.29 43.82,33.29 v44.84,34.31
  Bottom 0.305: v24.07,53.99 33.28,53.99 33.79,53.55 40.64,53.55 42.74,51.39 44.9,51.39 v46.36,50.05 | 25.85,32.4 15.53,32.4 v15.43,32.5 | D:R10.2 15.59,21.2 15.31,21.42 7.88,21.42 v7.12,21.04
  other vias: 15.59,20.45
D:IC2_3
  Top 0.305: D:R9.1 D:R15.1 14.04,22.33 D:IC6.1
D:IC2_4  (via drill 0.3)
  Top 0.305: v45.79,33.8 47.44,35.45 47.44,38.05 v48.77,39.39
  Top 0.406: D:R43.1 25.15,78.18 v25.4,78.12
  Bottom 0.254: 8.62,28.71 D:IC6.9 | v45.79,33.8 44.58,32.59 36.52,32.59 35.72,31.8 27.6,31.8 27.37,31.58 | D:R3.2 10.32,31.35 11.43,30.24
  Bottom 0.305: v25.4,78.12 43.09,78.12 43.11,78.15 48.17,78.15 49.47,76.85 49.47,40.09 v48.77,39.39 | 27.37,31.58 22.93,31.58 22.42,30.94 12.13,30.94 11.43,30.24 | 8.61,28.73 D:IC6.9 10.73,28.65 11.43,29.35 11.43,30.24 | 11.43,30.24 11.43,30.37
  other vias: 8.68,28.65 9.12,31.35
D:IC2_5
  Top 0.254: 12.45,23.58 11.69,24.4 11.69,36.4 12.07,36.78 D:R13.1 12.59,36.66 | 12.45,23.58 D:IC6.2 | D:R15.2 12.34,20.96 11.75,21.61 11.75,22.88 12.45,23.58
  Top 0.305: 13.94,23.51 D:IC6.2
D:IC2_6  (via drill 0.3)
  Top 0.254: D:R14.1 16.55,26.33 15.94,26.94 15.94,29.61 16.32,29.99 16.85,29.99 D:R21.1
  Bottom 0.254: D:IC6.7 16.78,29.92 D:R21.1
  Bottom 0.305: 13.91,30.01 D:IC6.7
  other vias: 13.88,29.92 16.87,30.01
D:IC2_7  (via drill 0.3)
  Top 0.254: 12.7,32.97 D:R19.1 12.36,32.88 12.36,29.19 12.9,28.66 D:IC6.6
  Bottom 0.254: D:IC6.6 16.46,28.65 D:R21.2
  other vias: 13.88,28.65 16.87,28.31
D:IC2_11  (via drill 0.3)
  Top 0.254: 6.84,19.41 6.94,19.38 6.92,19.41 D:R23.2 6.9,19.86 6.29,20.46 6.29,23.96 7.05,24.72 7.05,29.35 7.63,29.92 | 7.63,29.92 D:IC6.8 | 7.63,29.92 7.18,30.37 7.18,31.11 D:R3.1
  Bottom 0.305: D:IC6.8
  other vias: 8.68,29.92
D:N$1  (via drill 0.3)
  Top 0.254: D:R9.2 12.27,18.88 v12.27,18.81 | v26.36,28.46 26.36,25.23 25.98,24.91 25.98,18.56 26.42,18.11 | 26.42,18.11 26.61,17.93 | v25.98,16.91 25.98,17.67 26.42,18.11
  Top 0.305: 26.61,17.93 D:D4.1
  Bottom 0.254: v12.27,18.81 18.29,18.81 23.44,18.81 24.01,18.24 25.28,16.91 v25.98,16.91
  Bottom 0.305: v26.36,28.46 D:IC2.3
  other vias: 29.11,28.47
D:N$2
  Top 0.305: D:R5.1 37.23,31.36 D:C1.1
D:N$3
  Top 0.254: 21.47,31.83 21.48,31.83 D:R2.1 21.66,33.1 21.47,33.36 20.73,33.36 D:C3.1
  Top 0.305: 21.47,31.83 D:R2.1
D:N$4  (via drill 0.3)
  Top 0.254: D:R5.2 v38.93,29.67
  Top 0.305: v38.93,29.67 38.93,26.75 v37.47,24.91
  Top 0.406: D:IC2.15
  Bottom 0.305: D:R4.2 20.16,25.45 21.4,26.43 31.56,26.43 32.64,25.48 36.83,25.48 v37.47,24.91 | v38.93,29.67 34.32,29.67 D:IC2.15
  other vias: 34.31,29.74 20.16,24.72
D:N$5  (via drill 0.3)
  Top 0.305: D:R1.2 20.23,31.73 D:R2.2
  Bottom 0.305: D:IC2.2 24.52,29.74 23.75,29.04 20.83,29.04 D:R1.2
  other vias: 29.11,29.74 20.23,29.89
D:N$7  (via drill 0.3)
  Top 0.254: 16.51,24.08 v16.55,23.99 D:R14.2 | D:IC2.6 27.76,24.66 27.56,24.46 27.56,20.4 D:D4.2
  Top 0.305: 28.13,24.66 D:IC2.6 v28.52,24.66 | D:D4.2 27.05,19.82
  Bottom 0.254: v16.55,23.99 16.91,23.7 17.21,23.7 18.9,23.68 19.05,23.89
  Bottom 0.305: 19.05,23.89 26.1,23.89 26.8,24.59 28.45,24.59 v28.52,24.66
  other vias: 27.11,19.95
D:N$8  (via drill 0.3)
  Top 0.254: v30.48,16.15 30.48,19.51 30.55,19.57 30.55,20.07 D:D2.1 | v32.2,20.08 32.2,24.27 32.64,24.66 D:IC2.11
  Top 0.305: 34.25,24.72 D:IC2.11
  Bottom 0.254: v30.48,16.15 25.28,16.15 22.99,18.24 15.5,18.24 14.93,17.67 11.94,17.67 11.37,18.24 7.82,18.24 7.28,17.71 D:R23.1
  Bottom 0.305: D:D2.1 32.03,20.1 v32.2,20.08
  other vias: 34.31,24.66 30.52,20.1 6.9,17.71
D:N$11
  Top 0.254: D:C6.1 19.99,22.91 D:R17.1
D:N$12  (via drill 0.3)
  Bottom 0.254: D:IC2.7 28.66,22.94 26.29,22.94 D:R17.2 21.15,22.94 20.39,22.18 20.39,21.16 20.7,20.85 D:R16.2
  other vias: 21.72,22.94 29.11,23.39 20.7,19.76
D:N$14  (via drill 0.3)
  Top 0.254: v35.88,18.94 35.95,18.94 36.52,19.51 36.52,27.92 36.83,28.23 D:R20.2
  Top 0.406: 34.37,28.53 D:IC2.14
  Bottom 0.254: D:D2.2 28.62,19.41 29.15,18.88 v35.88,18.94
  Bottom 0.305: D:R20.2 35.86,28.23 35.63,28.46 D:IC2.14
  other vias: 37.38,28.23 34.31,28.47 28.62,20.1
D:N$17  (via drill 0.3)
  Bottom 0.305: D:R22.1 23.65,29.88 24.71,30.94 29.11,30.94 D:IC2.1
  other vias: 21.89,29.82 29.11,31.01
D:N$19  (via drill 0.3)
  Top 0.254: D:C5.1 35.97,17.63 37.53,19.19 37.53,21.61 D:R11.1
  Top 0.305: 35.33,17.62 D:C5.1 | D:R11.1 37.53,21.61
  other vias: 37.57,21.64
D:N$23  (via drill 0.3)
  Bottom 0.305: D:R7.2 21.76,24.76 22.74,25.67 31.25,25.67 32.26,24.78 33.6,23.39 D:IC2.10 34.6,23.39 D:R11.2
  other vias: 21.82,24.76 34.31,23.39 37.57,23.34
GND  (via drill 0.3)
  Top 0.254: IC2.12 33.07,7.91 | Q11.C 1.78,28.13 1.78,26.88 2.64,25.99 2.64,22.53 3.05,22.05 | Q6.C v2.74,18.12 2.93,18.12 Q6.C | 33.28,48.72 33.28,45.67 33.6,45.36 v33.6,44.79 33.6,42.25 32.27,40.92 C:C9.1 32.7,40.92 33.34,40.47 v33.34,36.53 33.34,35.2 30.61,32.34 28.52,32.34 28.01,32.85 v28.01,35.01 | C:C5.2 32.8,49.2 33.28,48.72 | 33.28,48.72 33.28,48.85 34.04,49.61 34.04,54.56 33.21,55.39 33.21,56.85 32.83,57.23 | v17.59,37.36 17.34,37.1 17.34,35.83 15.88,34.43 15.55,34.11 15.55,33.6 D:C8.2 14.35,33.6 13.91,33.17 v13.91,31.89 | B:C1.2 40.33,71.33 38.2,73.45 38.2,74.92 v38.04,75.07 | 33.25,83.84 A:IC2.8 | IC2.3 33.2,3.68 33.6,4.08 35.37,4.08 35.74,3.59 IC2.5 | R30.1 5.63,3.03 v5.66,3.19 | IC2.12 33.2,7.75 v33.21,7.57 | 33.21,7.53 IC2.12 | v35.18,14.62 35.2,15.78 D:C5.2 34.62,15.88 34.36,16.15 34.36,19.19 v35.06,19.83 | 35.76,8.53 35.76,7.57 IC2.10 35.74,6.67 35.86,6.45 36.2,5.99 v36.2,5.8 | v42.23,29.16 42.23,30.69 v42.49,30.94 | C10.2 44.41,3.21 OFFSET.1 | 3.05,22.05 2.67,21.73 Q6.C | 3.05,22.05 3.62,22.05 3.65,22.03 R50.1 | D:C1.2 38.95,37.32 v38.93,37.61
  Top 0.305: v42.2,21.38 42.14,21.19 Q10.1 | IC2.10 35.74,7.72 35.69,7.76 35.69,7.45 | v10.16,52.85 10.25,52.56 R40.1 10.25,53.08 9.91,53.42 v9.91,56.03 | A:IC2.8 33.02,83.91 v32.96,83.96 33.28,83.96 33.34,83.9 | A:C6.2 v37.73,98 v37.72,98 37.98,98 | A:C8.2 v31.81,95.78 v31.82,95.78 | B:C6.2 32.31,57.24 v32.26,57.23 32.83,57.23 33.15,57.55 33.15,61.76 B:IC2.8 33.15,62.05 33.02,61.93 | B:C14.2 37.74,57.24 v37.72,57.23 | B:C3.2 22.28,60.93 v22.42,60.79 | Q7.C v3.56,52.53 | IC5.3 | C:C5.2 31.9,49.02 32.26,49.23 31.82,49.17 | IC5.5 | v48.14,54.69 48.14,58.88 46.99,59.96 45.03,59.96 44.01,60.98 v44.01,62.25
  Top 0.406: A:C13.2 13.32,94.67 A:C1.2 A:C9.1 | A:C13.2 v12.92,94.51 | v9.11,94.51 A:C14.2 9.35,94.27 v9.11,94.51 | 13,94.43 13.08,94.51 | A:C3.2 A:C13.2 | C:IC2.8 22.86,42.26 v23.54,42.31 | 15.37,33.6 D:C8.2 15.49,33.6 | D3.1 8.66,96.23 v9.06,96.25 | v9.06,96.25 9.11,96.42 | 8.68,98.16 v8.7,98.19 8.83,98.19 8.77,98.25 | v9.11,94.51 9.11,96.2 v9.06,96.25 | D3.2 9.15,97.68 9.15,96.33 v9.06,96.25 | 9.82,5.35 R26.1
  Bottom 0.254: IC5.10 v33.6,44.79 | B:C5.2 48.68,63.87 48.26,63.45 45.79,63.45 44.58,62.25 v44.01,62.25 | Q3.C 2.78,3.59 3.24,3.13 5.59,3.13 | 5.59,3.13 v5.66,3.19 | v33.21,7.57 33.21,7.51 33.02,7.32 | D:C6.2 23.31,21.48 24.01,22.18 29.05,22.18 D:IC2.8 32.77,22.12 v35.06,19.83 40.66,19.83 v42.2,21.38 43.96,21.38 JP8.7 | v32.26,57.23 32.83,57.23 32.85,57.24 B:C9.1 37.71,57.24 v37.72,57.23 | D:C1.2 42.04,31.38 v42.49,30.94 | v35.18,14.62 35.63,14.62 36.14,14.11 38.68,14.11 38.87,13.92 38.87,12.79 J4.3 | JP8.3 43.31,25.48 41.91,26.88 41.91,28.85 v42.23,29.16 | 5.59,3.13 5.66,3.07 7.69,3.07 8.42,3.74 9.76,3.74 v9.72,3.76 | Q5.C 9.3,38.16 10.42,37.04 17.28,37.04 v17.59,37.36 | v36.2,5.8 36.9,5.03 41.12,5.03 OFFSET.1 | v38.93,37.61 36.14,37.61 34.99,36.47 33.47,36.47 v33.34,36.53 | D:C3.2 27.97,35.05 v28.01,35.01
  Bottom 0.305: B:C9.1 | 23.55,42.26 22.21,42.26 21.53,42.75 19.66,42.75 C:C6.2 | v37.54,42.25 IC5.3 | IC5.5 IC5.10 | v37.72,57.23 41.34,57.23 42.99,55.39 47.31,55.39 v48.14,54.69 | Q9.1 44.63,23.24 JP8.5
  other vias: 47.95,97.81 3.5,98.19 22.99,75.14 2.48,60.53 18.62,43.54 42.74,42.25 29.91,60.79 42.74,44.79 37.54,44.79 40.25,23.24 47.25,43.2 5.08,38.16 5.78,42.82 21.74,21.48 2.48,13.46 5.02,14.34 29.11,22.12 20.6,35.05 3.31,64.18 2.54,56.09 48.68,64.39 2.16,3.59 3.84,8.84 3.27,11.57 48.58,91.09 8.19,10.43 8.22,8.78 42.08,87.08 35.16,57.24 38.95,31.38 8.43,19.45 43.14,0.97 10.42,8.15 33.2,2.35 35.74,7.55 13.57,6.66 24.83,15.34 43.12,35.39 19.63,5.73
  pour Bottom: 55.73,107.39 -2.69,107.39 -2.69,-4.37 55.73,-4.37
  pour Top: 57,106.12 -1.42,106.12 -1.42,-5.64 57,-5.64
IN_A  (via drill 0.3)
  Top 0.254: R1.2 6.49,12.53 J3.5 | v4.39,10.49 4.39,10.11 4.96,9.48 4.96,6.05 4.39,5.42 4.39,1.1 5.08,0.46 20.13,0.46 20.39,0.78 20.39,2.14 IC1.3
  Bottom 0.254: R1.2 6.36,10.56 4.45,10.56 4.58,10.56 v4.39,10.49
  other vias: 6.49,10.43
IN_B  (via drill 0.3)
  Top 0.254: J3.4 9.14,11.84 10.67,10.3 11.88,10.3 12.32,9.86 12.32,2.19 R12.2
  Bottom 0.254: IC1.5 20.14,2.18 19.24,1.29 12.97,1.29 R12.2
  other vias: 22.84,2.18 12.78,1.48
IN_C  (via drill 0.3)
  Top 0.254: J3.2 14.23,11.19 13.57,10.4 R18.2
  Bottom 0.254: IC1.10 21.92,8.29 R18.2
  other vias: 13.57,8.36 22.84,7.38
IN_D  (via drill 0.3)
  Top 0.254: IC1.12 20.3,10.58 20.13,10.88 v20.13,12.15
  Top 0.305: R24.2 15.94,13.52 J3.1
  Bottom 0.254: J3.1 17.32,12.15 v20.13,12.15
ITOV_A  (via drill 0.3)
  Top 0.254: IC5.1 42.74,39 41.79,38.12 41.79,35.32 40.71,34.24 40.71,27 39.31,25.29 39.31,18.75 39.5,18.56 C8.1 v39.48,16.62
  Bottom 0.254: R3.1 31.34,15.47 32.33,16.53 37.7,16.53 R58.2 v39.48,16.62
  other vias: 31.34,14.97 37.79,16.62
ITOV_B  (via drill 0.3)
  Top 0.254: v25.02,35.83 25.06,35.68 R2.1 24.09,34.33 23.63,33.86 23.63,20.34 22.67,19.38 v22.67,14.11 | v43.57,36.53 43.57,37.99 44.2,38.62 44.2,46.88 43.76,47.33 IC5.7
  Bottom 0.254: IC5.7 45.09,47.33 45.66,47.9 47.04,47.9 C9.1 | v25.02,35.83 38.74,35.83 39.44,36.53 v43.57,36.53 | R59.2 26.42,14.69 25.72,14.24 22.8,14.24 v22.67,14.11
  other vias: 42.74,47.33 47.38,47.88 29.3,14.69
ITOV_C  (via drill 0.3)
  Top 0.254: C12.1 36.77,48.53 37.54,47.77 IC5.8 38.55,47.33 39.31,46.56 39.31,40.59 40.07,39.96 40.01,27.13 38.55,25.23 38.55,19.26 36.33,17.04 36.33,14.69 37.66,13.42 37.66,11.51 38.82,10.42 R4.1
  Bottom 0.254: C12.1 38.45,49.12 R56.2
  other vias: 36.77,49.12 38.49,49.08
ITOV_D
  Top 0.254: IC5.14 37.52,39.69 C7.1 37.52,34.67 36.58,33.74 36.58,33.14 R57.2 36.54,32.62 35.88,31.96 35.88,21.8 33.79,19.7 33.79,14.69 32.58,13.61 32.58,11.88 32.59,11.88 33.85,10.62 33.85,10.23 R19.1
LED_1  (via drill 0.3)
  Top 0.254: JP5.1 2.54,30.27 2.54,28.4 2.8,28.15 4.39,28.15 4.7,27.89 4.7,19.26 5.91,18.3 5.91,15.64 v6.48,15.07 | v25.78,12.76 25.57,12.86 | R33.1 26.08,10.71 25.79,11 25.79,12.31 v25.78,12.76 | Q1.E v25.78,12.76
  Bottom 0.254: v6.48,15.07 6.48,15 7.18,14.18 20.52,14.18 21.79,12.72 25.42,12.72 v25.78,12.76
LED_2  (via drill 0.3)
  Top 0.254: JP5.2 1.95,33.86 2.48,33.86 3.31,33.04 3.31,31.39 3.9,30.73 v4.13,30.66 4.13,30.73 R53.1 | Q2.E 0.96,16.23 0.96,24.59 v1.78,25.29
  Bottom 0.254: v4.13,30.66 4.13,28.78 2.86,27.58 2.86,26.37 v1.78,25.29
LED_3  (via drill 0.3)
  Top 0.254: Q3.E 3.11,3.57 v3.62,4.4
  Bottom 0.254: v3.62,4.4 R54.1
  Bottom 0.305: JP5.3 2.18,36.09 2.89,36.09 3.34,35.32 3.34,29.92 0.99,27.7 0.99,14.75 1.44,14.37 1.44,6.2 v3.62,4.4
  other vias: 5.7,4.4
LED_4
  Top 0.305: JP5.4 1.36,38.91 0.45,38.05 0.45,8.76 Q4.E 1.57,7.51 R55.1
LED_5  (via drill 0.3)
  Top 0.254: Q11.E 4.7,29.1 5.02,29.48 5.02,34.78 R51.1
  Top 0.305: JP5.5 2.01,41.55 2.54,41.55 3.18,40.91 3.18,37.61 4.13,36.59 v4.13,35.64 R51.1
LED_6  (via drill 0.3)
  Top 0.254: 4.07,40.29 Q5.E
  Top 0.305: JP5.6 1.94,43.96 3.5,43.96 4.07,43.39 4.07,40.11 Q5.E 3.88,40.1
  Bottom 0.254: Q5.E 4.26,40.3 R36.1
  other vias: 4.13,40.36 7.56,40.3
LED_7  (via drill 0.3)
  Top 0.254: Q6.E 1.79,23.95 v1.85,24.02 | 8.96,36.94 R48.1 | R48.1 9.51,36.81 9.85,36.4 9.85,33.74 8.45,32.34 6.67,32.34 6.35,32.02 v6.35,25.42 | R48.1 8.77,36.91 v8.83,36.98
  Bottom 0.254: 1.85,20.23 Q6.E 1.91,20.3 | v1.85,24.02 3.12,25.29 6.16,25.29 v6.35,25.42
  Bottom 0.305: JP5.7 2.36,46.43 2.71,46.12 3.34,45.48 3.34,37.51 3.88,36.98 v8.83,36.98
  other vias: 1.79,20.23
LED_8  (via drill 0.3)
  Top 0.305: 1.83,49.15 JP5.8 1.38,49.6 Q7.E
  Bottom 0.305: JP5.8 R52.1
  other vias: 5.02,49.06
N$3  (via drill 0.3)
  Top 0.254: v18.39,61.01 18.39,51.61 17.4,50.82 17.4,39.32 18.36,38.56 18.36,26.81 18.55,26.62 18.55,23.32 17.15,21.73 17.15,15.83 18.1,14.56 18.1,11.83 17.47,11.19 17.09,11.19 16.6,10.71 R27.1 | IC1.7 IC1.6 24.13,2.21 24.13,3.26 22.48,4.91 17.53,4.91 16.45,5.99 16.45,9.64 R27.1 | 16.67,9.86 R27.1
  Top 0.305: 27.56,66.07 B:R4.1 | B:R4.1 28.62,66.16 29.09,66.63 29.09,67.64 29.28,67.84 30.21,67.84 B:R7.1 | B:R16.1 26.78,61.65 27.12,61.99 27.12,64.85 27.63,65.36 27.63,66.14 B:R4.1
  Bottom 0.254: B:R16.1 19.03,61.65 v18.39,61.01 18.36,60.98
  Bottom 0.305: B:R1.1 22.31,67.44 22.86,66.88 27.05,66.88 B:R4.1
  other vias: 26.03,61.65 22.31,68.76 27.78,66.16
N$4  (via drill 0.3)
  Top 0.254: 11.12,5.2 R26.2 | 11.43,4.78 11.43,4.46 10.8,3.7 R25.2 | 11.43,4.78 11.43,5.33 | v22.67,9.29 22.67,11.07 23.88,12.27 Q1.B | R26.2 11.43,5.42 | 11.43,5.42 v11.43,8.97 | R26.2 11.43,5.42 | 11.43,5.42 11.43,4.78
  Bottom 0.254: v11.43,8.97 12.39,8.97 12.51,9.16 22.48,9.16 v22.67,9.29
N$5  (via drill 0.3)
  Top 0.406: JP8.9 JP8.10 | v41.24,19 Q10.3
  Bottom 0.254: JP8.9 43.78,19 v41.24,19
  Bottom 0.305: 44.62,17.86 JP8.9
N$6  (via drill 0.3)
  Top 0.254: Q2.B 3.43,13.23 5.47,11.32 5.47,9.1 5.66,8.78 R28.2
  Bottom 0.254: 6.55,8.8 R28.2 7.35,9.61 9.47,9.61 9.85,9.92 R27.2
  other vias: 6.52,8.78 14.9,9.92
N$7  (via drill 0.3)
  Top 0.254: 31.94,2.37 IC2.2 31.88,2.4 v31.88,5.29 | R7.1 29.1,5.15 v28.9,5.29 28.78,5.53 28.78,8.51 27.69,9.61 v27.69,11.57 | v31.37,11.57 31.37,13.23 R3.2
  Bottom 0.254: v28.9,5.29 v31.88,5.29 | v27.69,11.57 v31.37,11.57
N$8  (via drill 0.3)
  Top 0.254: v32.83,15.32 32.83,18.81 33.21,19.26 v33.21,20.53 | v27.12,40.59 27.12,39.45 27.25,39.32 27.25,27.58 27.63,27.2 | 27.63,27.2 28.19,27.2 | v26.74,21.29 26.74,24.78 27.31,25.35 27.31,26.88 27.63,27.2
  Top 0.305: A:IC2.4 30.61,88.98 29.85,88.22 29.85,84.47 30.48,83.84 30.48,79.96 29.72,79.2 28.26,79.2 27.31,78.25 27.31,74.25 27.82,73.74 33.28,73.74 35.18,71.84 35.18,67.71 34.61,67.14 B:IC2.4 31.88,67.14 31.5,66.76 31.5,65.11 30.99,64.6 29.72,64.6 28.39,63.39 28.39,61.42 26.86,59.84 26.86,55.39 26.36,54.75 26.29,54.69 v26.29,47.33 26.29,46.05 27.12,45.23 v27.12,40.59 | IC5.2 42.36,40.91 v42.55,40.91 | 28.19,27.2 D:IC2.4
  Bottom 0.254: v26.74,21.29 32.52,21.29 v33.21,20.53 | v32.83,15.32 33.98,15.32 34.29,15.51 36.01,15.51 36.58,14.94 37.76,14.94 R58.1 39.48,14.92 C8.2
  Bottom 0.305: v26.29,47.33 23.43,47.33 C:IC2.4 | v27.12,40.59 35.25,40.59 36.2,39.64 40.26,39.64 41.53,40.91 v42.55,40.91
  other vias: 33.45,67.14 23.67,47.34 39.5,14.89 37.79,14.92
N$9  (via drill 0.3)
  Top 0.254: D:IC2.12 33.54,25.93 33.53,25.93